# EAGLE design Stick IMUinator v2.1 (EAGLE 6.2)
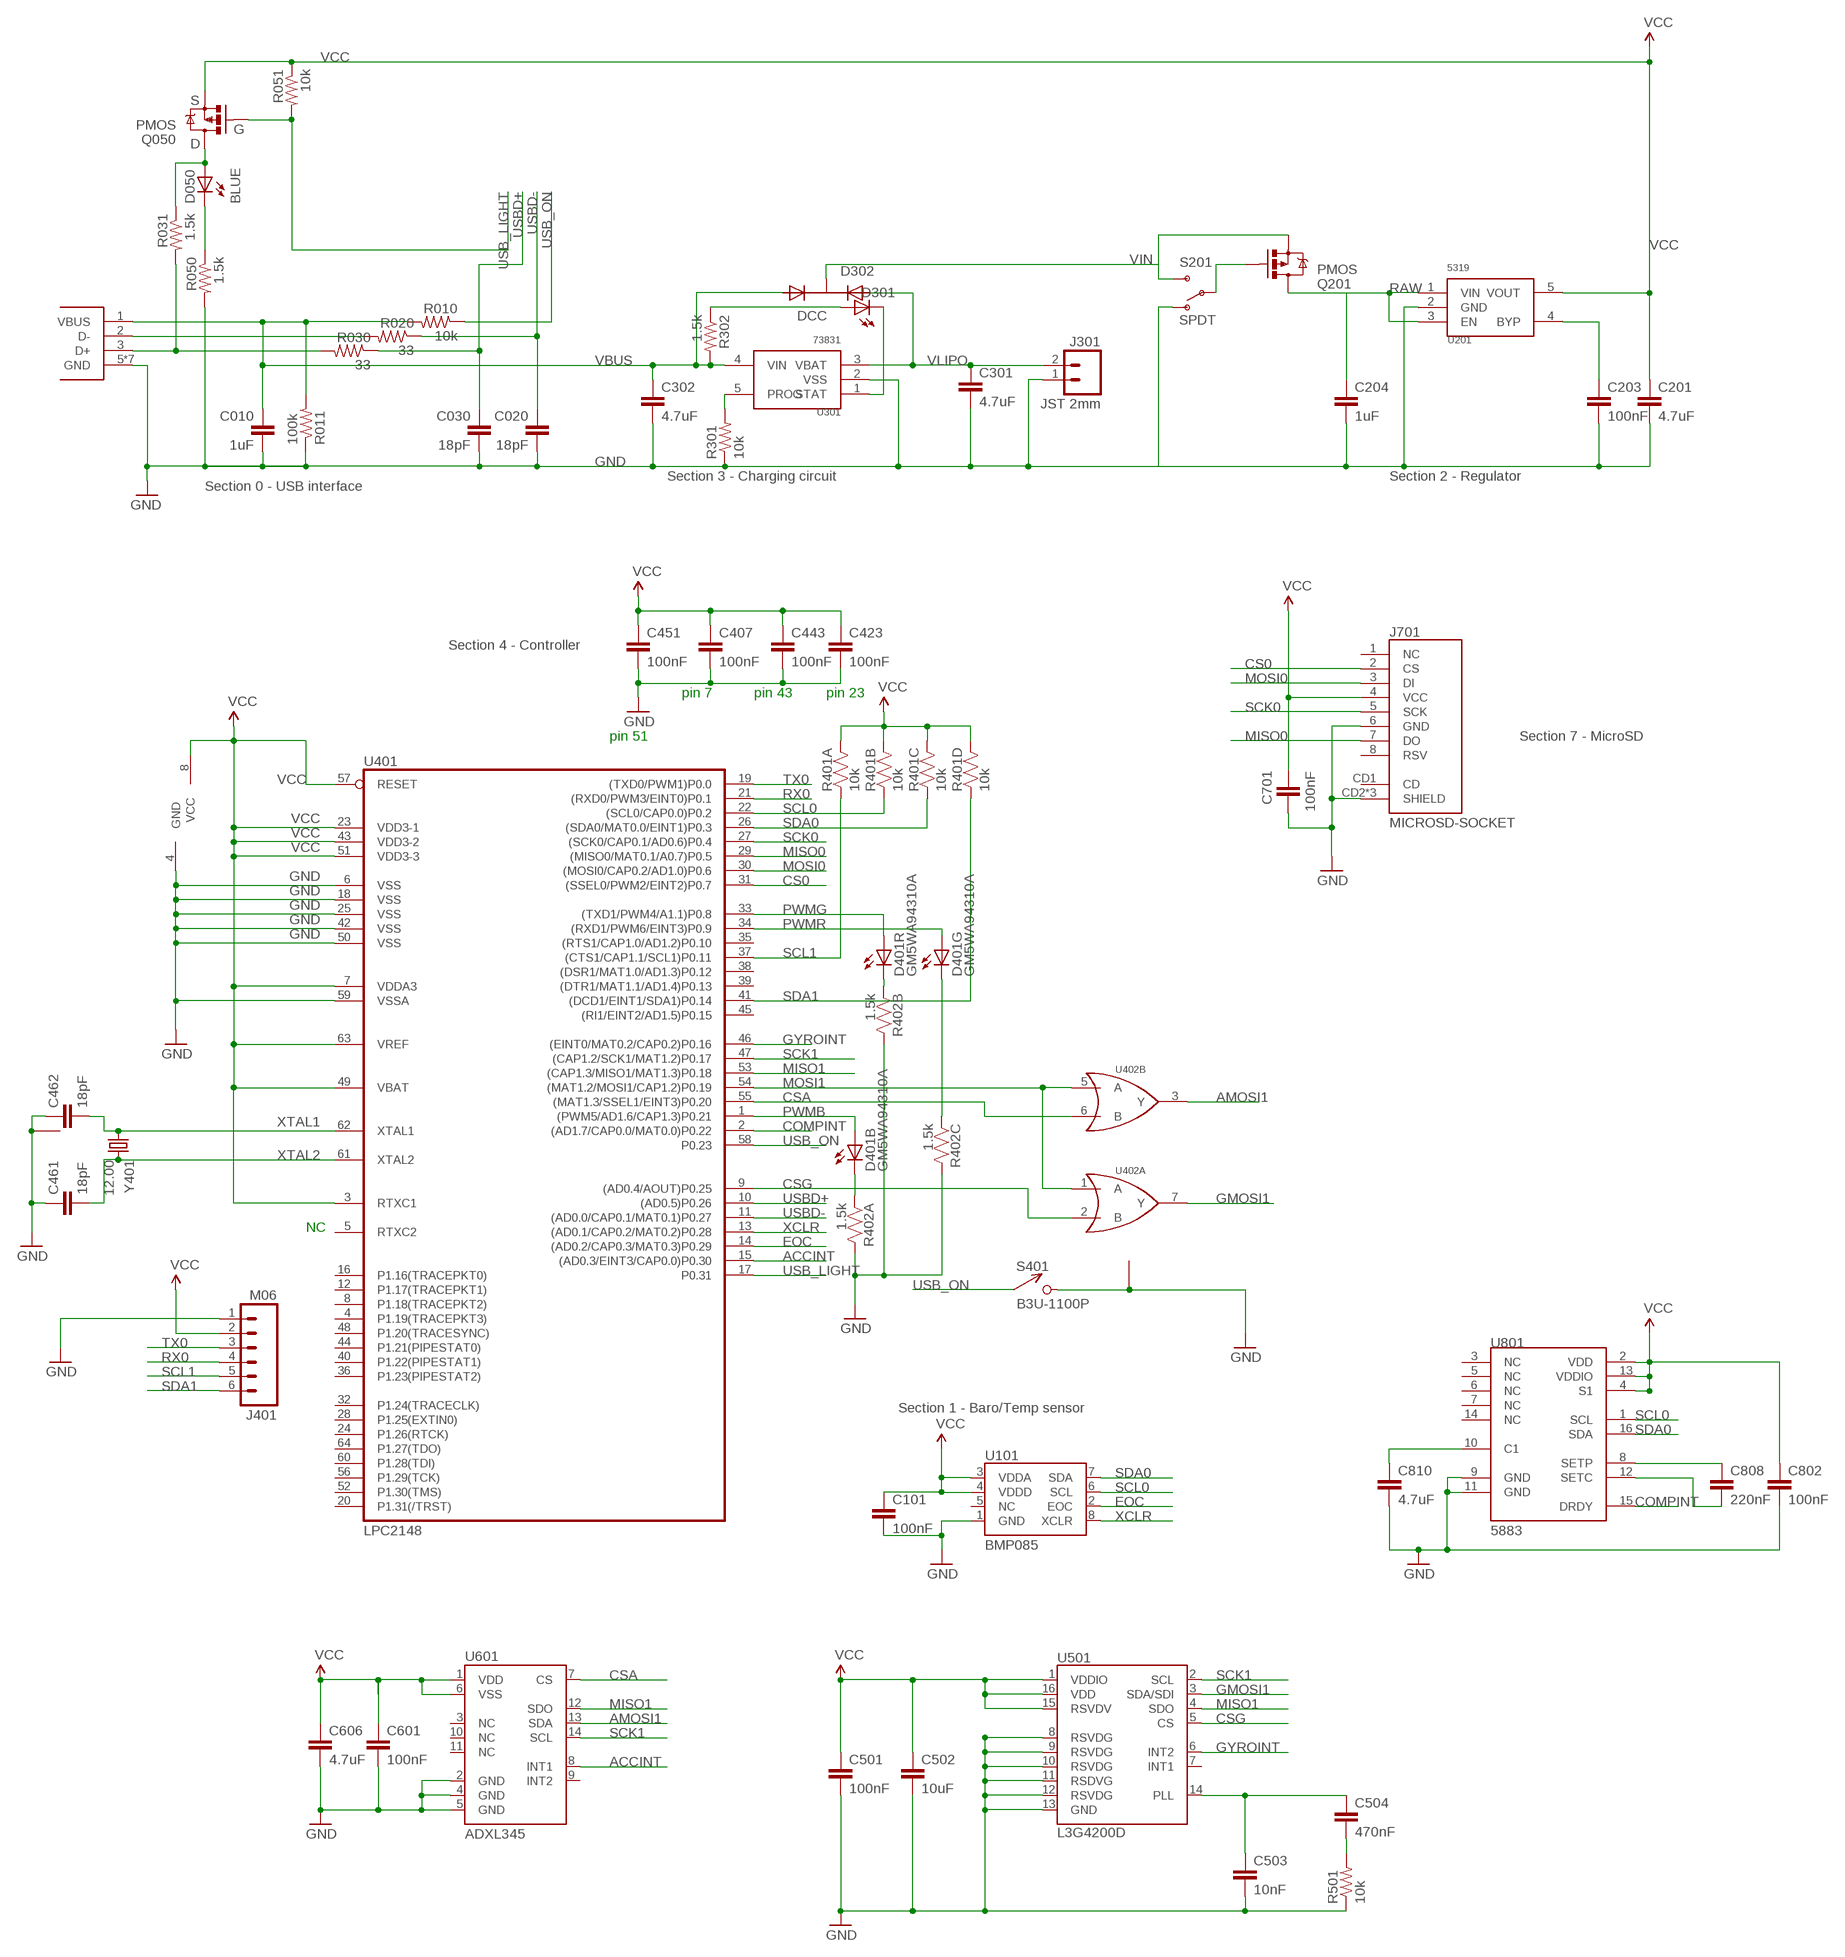
[diagram p0: schematic, sheet 1]

## Parts
C010  1uF  CAP0402-CAP  [0402-CAP]
C020  18pF  CAP0402-CAP  [0402-CAP]
C030  18pF  CAP0402-CAP  [0402-CAP]
C101  100nF  CAP0402-CAP  [0402-CAP]
C201  4.7uF  CAP0402-CAP  [0402-CAP]
C203  100nF  CAP0402-CAP  [0402-CAP]
C204  1uF  CAP0402-CAP  [0402-CAP]
C301  4.7uF  CAP0402-CAP  [0402-CAP]
C302  4.7uF  CAP0402-CAP  [0402-CAP]
C407  100nF  CAP0402-CAP  [0402-CAP]
C423  100nF  CAP0402-CAP  [0402-CAP]
C443  100nF  CAP0402-CAP  [0402-CAP]
C451  100nF  CAP0402-CAP  [0402-CAP]
C461  18pF  CAP0402-CAP  [0402-CAP]
C462  18pF  CAP0402-CAP  [0402-CAP]
C501  100nF  CAP0402-CAP  [0402-CAP]
C502  10uF  CAP0603-CAP  [0603-CAP]
C503  10nF  CAP0402-CAP  [0402-CAP]
C504  470nF  CAP0402-CAP  [0402-CAP]
C601  100nF  CAP0402-CAP  [0402-CAP]
C606  4.7uF  CAP0402-CAP  [0402-CAP]
C701  100nF  CAP0402-CAP  [0402-CAP]
C802  100nF  CAP0402-CAP  [0402-CAP]
C808  220nF  CAP0402-CAP  [0402-CAP]
C810  4.7uF  CAP0402-CAP  [0402-CAP]
D050  BLUE  LED0603  [LED-0603]
D301  YELLOW  LED0603  [LED-0603]
D302  DCC  PMEG2005CT  [SOT-23-3]
D401  GM5WA94310A  [GM5WA94310A]
J001  USB_MICROB_JST  [UB-MC5BR3-SD204-4S]
J301  JST 2mm  M02-JST-2MM-SMT  [JST-2-SMD]
J401  M06  M06LOCK  [1X06_LOCK]
J701  MICROSD-SOCKET  [MICROSD-SOCKET-PP]
Q050  PMOS  MOSFET-PCHANNELSMD  [SOT23-3]
Q201  PMOS  MOSFET-PCHANNELSMD  [SOT23-3]
R010  10k  RESISTOR0402-RES  [0402-RES]
R011  100k  RESISTOR0402-RES  [0402-RES]
R020  33  RESISTOR0402-RES  [0402-RES]
R030  33  RESISTOR0402-RES  [0402-RES]
R031  1.5k  RESISTOR0402-RES  [0402-RES]
R050  1.5k  RESISTOR0402-RES  [0402-RES]
R051  10k  RESISTOR0402-RES  [0402-RES]
R301  10k  RESISTOR0402-RES  [0402-RES]
R302  1.5k  RESISTOR0402-RES  [0402-RES]
R401  10k  RP404  [CRA04]
R402  1.5k  RP404  [CRA04]
R501  10k  RESISTOR0402-RES  [0402-RES]
S201  SPDT  SWITCH-SPSTSMD  [AYZ0202]
S401  B3U-1100P  [B3U-1100P]
U101  BMP085  [BMP085]
U201  5319  MIC5319D5  [SOT-23-5]
U301  73831  MCP73831  [SOT-23-5]
U401  LPC2148  LPC213X  [SQFP-S-10X10-64]
U402  7432  SN74LVC2G32  [DCU_8]
U501  L3G4200D  [LGA16-4X4]
U601  ADXL345  [LGA14]
U801  5883  HMC5883LSMD  [16LPCC]
Y401  12.00  TSX-3225  [CRYSTAL_SMD]

## Nets
ACCINT: U401.15((AD0.3/EINT3/CAP0.0)P0.30) U601.8(INT1)
AMOSI1: U402.3(B:Y) U601.13(SDA)
COMPINT: U401.2((AD1.7/CAP0.0/MAT0.0)P0.22) U801.15(DRDY)
CONN_D+: J001.3(D+) R030.2 R031.2
CONN_D-: J001.2(D-) R020.2
CS0: J701.2(CS) U401.31((SSEL0/PWM2/EINT2)P0.7)
CSA: U401.55((MAT1.3/SSEL1/EINT3)P0.20) U402.6(B:B) U601.7(CS)
CSG: U401.9((AD0.4/AOUT)P0.25) U402.2(A:B) U501.5(CS)
EOC: U101.2(EOC) U401.14((AD0.2/CAP0.3/MAT0.3)P0.29)
GMOSI1: U402.7(A:Y) U501.3(SDA/SDI)
GND [power]: C010.2 C020.2 C030.2 C101.2 C201.2 C203.2 C204.2 C301.2 C302.2 C407.2 C423.2 C443.2 C451.2 C461.1 C462.1 C501.2 C502.2 C503.2 C601.2 C606.2 C701.2 C802.2 C810.2 J001.5(GND) J001.P$6(GND) J001.P$7(GND) J001.P$8(GND) J001.P$9(GND) J001.P$10(GND) J001.P$11(GND) J301.1 J401.1 J701.6(GND) J701.CD2(SHIELD) J701.GND1(SHIELD) J701.GND3(SHIELD) R011.1 R050.2 R301.1 R402.6 R402.7 R402.8 R501.1 S201.1(O) S401.P$2 S401.P$3 U101.1(GND) U201.2(GND) U301.2(VSS) U401.6(VSS) U401.18(VSS) U401.25(VSS) U401.42(VSS) U401.50(VSS) U401.59(VSSA) U402.4(PWR:GND) U501.8(RSVDG) U501.9(RSVDG) U501.10(RSVDG) U501.11(RSDVG) U501.12(RSVDG) U501.13(GND) U601.2(GND) U601.4(GND) U601.5(GND) U801.9(GND) U801.11(GND) Y401.2 Y401.4
GYROINT: U401.46((EINT0/MAT0.2/CAP0.2)P0.16) U501.6(INT2)
MISO0: J701.7(DO) U401.29((MISO0/MAT0.1/A0.7)P0.5)
MISO1: U401.53((CAP1.3/MISO1/MAT1.3)P0.18) U501.4(SDO) U601.12(SDO)
MOSI0: J701.3(DI) U401.30((MOSI0/CAP0.2/AD1.0)P0.6)
MOSI1: U401.54((MAT1.2/MOSI1/CAP1.2)P0.19) U402.1(A:A) U402.5(B:A)
N$1: C504.2 R501.2
N$2: R301.2 U301.5(PROG)
N$3: D401.4(G:C) R402.3
N$4: D301.C U301.1(STAT)
N$5: D301.A R302.1
N$6: D050.A Q050.3(D) R031.1
N$7: D050.C R050.1
N$8: D401.5(R:C) R402.2
N$10: Q201.1(G) S201.2(P)
N$12: D401.6(B:C) R402.1
N$14: C808.1 U801.8(SETP)
N$15: C808.2 U801.12(SETC)
N$16: C810.1 U801.10(C1)
N$17: C203.1 U201.4(BYP)
N$20: C503.1 C504.1 U501.14(PLL)
PWMB: D401.1(B:A) U401.1((PWM5/AD1.6/CAP1.3)P0.21)
PWMG: D401.3(G:A) U401.34((RXD1/PWM6/EINT3)P0.9)
PWMR: D401.2(R:A) U401.33((TXD1/PWM4/A1.1)P0.8)
RAW: C204.1 Q201.3(D) U201.1(VIN) U201.3(EN)
RX0: J401.4 U401.21((RXD0/PWM3/EINT0)P0.1)
SCK0: J701.5(SCK) U401.27((SCK0/CAP0.1/AD0.6)P0.4)
SCK1: U401.47((CAP1.2/SCK1/MAT1.2)P0.17) U501.2(SCL) U601.14(SCL)
SCL0: R401.2 U101.6(SCL) U401.22((SCL0/CAP0.0)P0.2) U801.1(SCL)
SCL1: J401.5 R401.1 U401.37((CTS1/CAP1.1/SCL1)P0.11)
SDA0: R401.3 U101.7(SDA) U401.26((SDA0/MAT0.0/EINT1)P0.3) U801.16(SDA)
SDA1: J401.6 R401.4 U401.41((DCD1/EINT1/SDA1)P0.14)
TX0: J401.3 U401.19((TXD0/PWM1)P0.0)
USB_LIGHT: Q050.1(G) R051.2 U401.17(P0.31)
USB_ON: R010.1 S401.P$1 U401.58(P0.23)
USBD+: C030.1 R030.1 U401.10((AD0.5)P0.26)
USBD-: C020.1 R020.1 U401.11((AD0.0/CAP0.1/MAT0.1)P0.27)
VBUS: C010.1 C302.1 D302.1(A1) J001.1(VBUS) R010.2 R011.2 R302.2 U301.4(VIN)
VCC [power]: C101.1 C201.1 C407.1 C423.1 C443.1 C451.1 C501.1 C502.1 C601.1 C606.1 C701.1 C802.1 J401.2 J701.4(VCC) Q050.2(S) R051.1 R401.5 R401.6 R401.7 R401.8 U101.3(VDDA) U101.4(VDDD) U201.5(VOUT) U401.3(RTXC1) U401.7(VDDA3) U401.23(VDD3-1) U401.43(VDD3-2) U401.49(VBAT) U401.51(VDD3-3) U401.57(RESET) U401.63(VREF) U402.8(PWR:VCC) U501.1(VDDIO) U501.15(RSVDV) U501.16(VDD) U601.1(VDD) U601.6(VSS) U801.2(VDD) U801.4(S1) U801.13(VDDIO)
VIN: D302.3(K) Q201.2(S) S201.3(S)
VLIPO: C301.1 D302.2(A2) J301.2 U301.3(VBAT)
XCLR: U101.8(XCLR) U401.13((AD0.1/CAP0.2/MAT0.2)P0.28)
XTAL1: C462.2 U401.62(XTAL1) Y401.1
XTAL2: C461.2 U401.61(XTAL2) Y401.3
Unconnected: J701.1(NC) J701.8(RSV) J701.CD1(CD) R402.4 R402.5 U101.5(NC) U401.4(P1.19(TRACEPKT3)) U401.5(RTXC2) U401.8(P1.18(TRACEPKT2)) U401.12(P1.17(TRACEPKT1)) U401.16(P1.16(TRACEPKT0)) U401.20(P1.31(/TRST)) U401.24(P1.26(RTCK)) U401.28(P1.25(EXTIN0)) U401.32(P1.24(TRACECLK)) U401.35((RTS1/CAP1.0/AD1.2)P0.10) U401.36(P1.23(PIPESTAT2)) U401.38((DSR1/MAT1.0/AD1.3)P0.12) U401.39((DTR1/MAT1.1/AD1.4)P0.13) U401.40(P1.22(PIPESTAT1)) U401.44(P1.21(PIPESTAT0)) U401.45((RI1/EINT2/AD1.5)P0.15) U401.48(P1.20(TRACESYNC)) U401.52(P1.30(TMS)) U401.56(P1.29(TCK)) U401.60(P1.28(TDI)) U401.64(P1.27(TDO)) U501.7(INT1) U601.3(NC) U601.9(INT2) U601.10(NC) U601.11(NC) U801.3(NC) U801.5(NC) U801.6(NC) U801.7(NC) U801.14(NC)

## Notes on the sheet
- S
- G
- D
- Section 0 - USB interface | Section 3 - Charging circuit | Section 2 - Regulator
- Section 4 - Controller
- pin 7 | pin 43 | pin 23
- pin 51 | Section 7 - MicroSD
- NC
- Section 1 - Baro/Temp sensor

## Library data of the parts
C010 C204 = SparkFun:CAP: Capacitor Standard 0603 ceramic capacitor, and 0.1" leaded capacitor.; DIGIKEY: 445-1415-1-ND
C020 C030 C461 C462 = SparkFun:CAP: Capacitor Standard 0603 ceramic capacitor, and 0.1" leaded capacitor.; DIGIKEY: 445-1238-1-ND
C101 C203 C407 C423 C443 C451 C501 C601 C701 C802 = SparkFun:CAP: Capacitor Standard 0603 ceramic capacitor, and 0.1" leaded capacitor.; DIGIKEY: 445-1268-1-ND
C201 C301 C302 C606 C810 = SparkFun:CAP: Capacitor Standard 0603 ceramic capacitor, and 0.1" leaded capacitor.; DIGIKEY: 445-7395-1-ND
C502 = SparkFun:CAP: Capacitor Standard 0603 ceramic capacitor, and 0.1" leaded capacitor.; DIGIKEY: 445-7486-1-ND
C503 = SparkFun:CAP: Capacitor Standard 0603 ceramic capacitor, and 0.1" leaded capacitor.; DIGIKEY: 445-4943-1-ND
C504 = SparkFun:CAP: Capacitor Standard 0603 ceramic capacitor, and 0.1" leaded capacitor.; DIGIKEY: 445-4976-1-ND
C808 = SparkFun:CAP: Capacitor Standard 0603 ceramic capacitor, and 0.1" leaded capacitor.; DIGIKEY: 445-4972-1-ND
D050 D301 = SparkFun:LED: LEDs Standard schematic elements and footprints for 5mm, 3mm, 1206, and 0603 sized LEDs. 5mm - Spark Fun Electronics SKU : COM-00529 (and others); DIGIKEY: 350-2029-1-ND
D302 = KwanSystems:PMEG2005CT; DIGIKEY: 568-6500-1-ND
D401 = led:GM5WA94310A: Chip LED RGB Source: http://document.sharpsma.com/files/GM5WA94310A_SS.pdf; DIGIKEY: 425-2728-1-ND
J001 = KwanSystems:USB_MICROB_JST; DIGIKEY: 455-2562-1-ND
J301 = SparkFun:M02: Header 2 Standard 2-pin 0.1" header. Use with straight break away headers (SKU : PRT-00116), right angle break away headers (PRT-00553), swiss pins (PRT-00743), machine pins (PRT-00117), and female headers (PRT-00115). Molex polarized connector foot print use with SKU : PRT-08233 with associated crimp pins and housings.; DIGIKEY: 455-1749-1-ND
J401 = SparkFun:M06: Header 6 Standard 6-pin 0.1" header. Use with straight break away headers (SKU : PRT-00116), right angle break away headers (PRT-00553), swiss pins (PRT-00743), machine pins (PRT-00117), and female headers (PRT-00115). Molex polarized connector foot print use with SKU : PRT-08094 with associated crimp pins and housings. NOTES ON THE VARIANTS LOCK and LOCK_LONGPADS... This footprint was designed to help hold the alignment of a through-hole component (i.e. 6-pin header) while soldering it into place. You may notice that each hole has been shifted either up or down by 0.005 of an inch from it's more standard position (which is a perfectly straight line). This slight alteration caused the pins (the squares in the middle) to touch the edges of the holes. Because they are alternating, it causes a "brace" to hold the component in place. 0.005 has proven to be the perfect amount of "off-center" position when using our standard breakaway headers. Although looks a little odd when you look at the bare footprint, once you have a header in there, the alteration is very hard to notice. Also, if you push a header all the way into place, it is covered up entirely on the bottom side. This idea of altering the position of holes to aid alignment will be further integrated into the Sparkfun Library for other footprints. It can help hold any component with 3 or more connection pins.; DIGIKEY: $NOPART
J701 = KwanSystems:MICROSD-SOCKET: microSD Socket Push-push type uSD socket. Digikey 101-00660-68-6-1-ND. tDoc lines correctly indicate media card edge positions when inserting (unlocked, locked, depressed).; DIGIKEY: 101-00581-59-1-ND
Q050 Q201 = SparkFun:MOSFET-PCHANNEL; DIGIKEY: NTR1P02T1GOSCT-ND
R010 R051 R301 R501 = SparkFun:RESISTOR: Resistor Basic schematic elements and footprints for 0603, 1206, and PTH resistors.; DIGIKEY: P10.0KLCT-ND
R011 = SparkFun:RESISTOR: Resistor Basic schematic elements and footprints for 0603, 1206, and PTH resistors.; DIGIKEY: P100KLCT-ND
R020 R030 = SparkFun:RESISTOR: Resistor Basic schematic elements and footprints for 0603, 1206, and PTH resistors.; DIGIKEY: P33.0LCT-ND
R031 R050 R302 = SparkFun:RESISTOR: Resistor Basic schematic elements and footprints for 0603, 1206, and PTH resistors.; DIGIKEY: P1.50KLCT-ND
R401 = KwanSystems:RP4; DIGIKEY: CRA4S810KCT-ND
R402 = KwanSystems:RP4; DIGIKEY: CRA4S81.5KCT-ND
S201 = SparkFun:SWITCH-SPST: SPST Switch Simple slide switch. Spark Fun Electronics SKU : COM-00102; DIGIKEY: 401-2013-1-ND
S401 = KwanSystems:B3U-1100P; DIGIKEY: SW1021CT-ND
U101 = SparkFun:BMP085: BMP085 Pressure Sensor Great little MEMS pressure sensor. SKU: COM-09603; DIGIKEY: 828-1005-1-ND
U201 = KwanSystems:MIC5319; DIGIKEY: 576-1910-1-ND
U301 = KwanSystems:MCP73831; DIGIKEY: MCP73831T-2ACI/OTCT-ND
U401 = SparkFun:LPC213X: LPC213x Schematic element and footprint for NXP LPC213x. Spark Fun Electronics SKU : COM-00520; DIGIKEY: 568-1765-ND
U402 = KwanSystems:SN74LVC2G32; DIGIKEY: 296-13268-1-ND
U501 = SparkFun:L3G4200D: L3G4200D Three-axis, digital output gyroscope The L3G4200D is a low-power three-axis angular rate sensor, has a full scale of ±250/±500/±2000 dps and is capable of measuring rates with a user-selectable bandwidth. It includes a sensing element and an IC interface capable of providing the measured angular rate to the external world through a digital interface (I2C/SPI). Package: 4x4x1.1 LGA-16 (LGA16-4x4.PAC); DIGIKEY: 497-11071-1-ND
U601 = SparkFun:ADXL345; DIGIKEY: ADXL345BCCZ-RL7CT-ND
U801 = SparkFun:HMC5883L: 3 Axis Digital Compass IC; DIGIKEY: 342-1082-1-ND
Y401 = KwanSystems:TSX-3225; DIGIKEY: 887-1316-1-ND

## Net classes
0 default: width 0.152 mm, drill 0.33 mm, clearance 0.152 mm
1 power: width 0.152 mm, drill 0.33 mm, clearance 0.152 mm to class 0, clearance 0.152 mm
2 hv: width 0.152 mm, drill 0.33 mm, clearance 0.152 mm to class 0, clearance 0.152 mm to class 1, clearance 0.152 mm

## Board
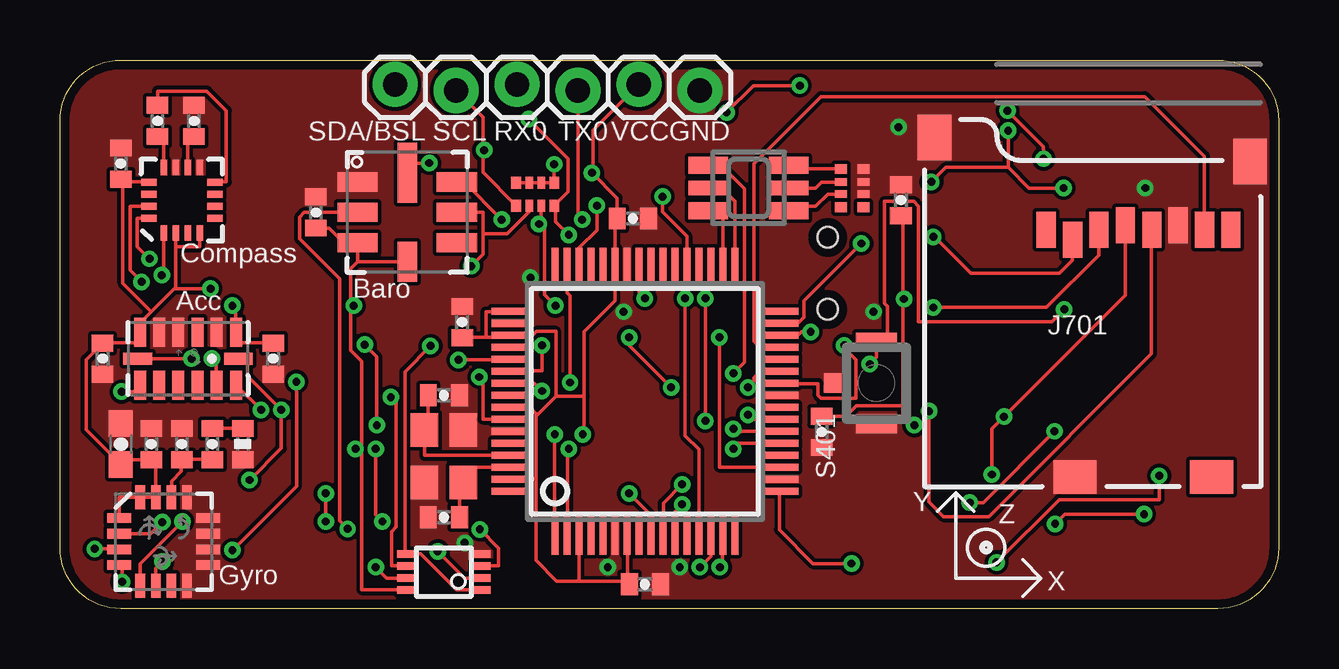
[diagram p1: board, top side]
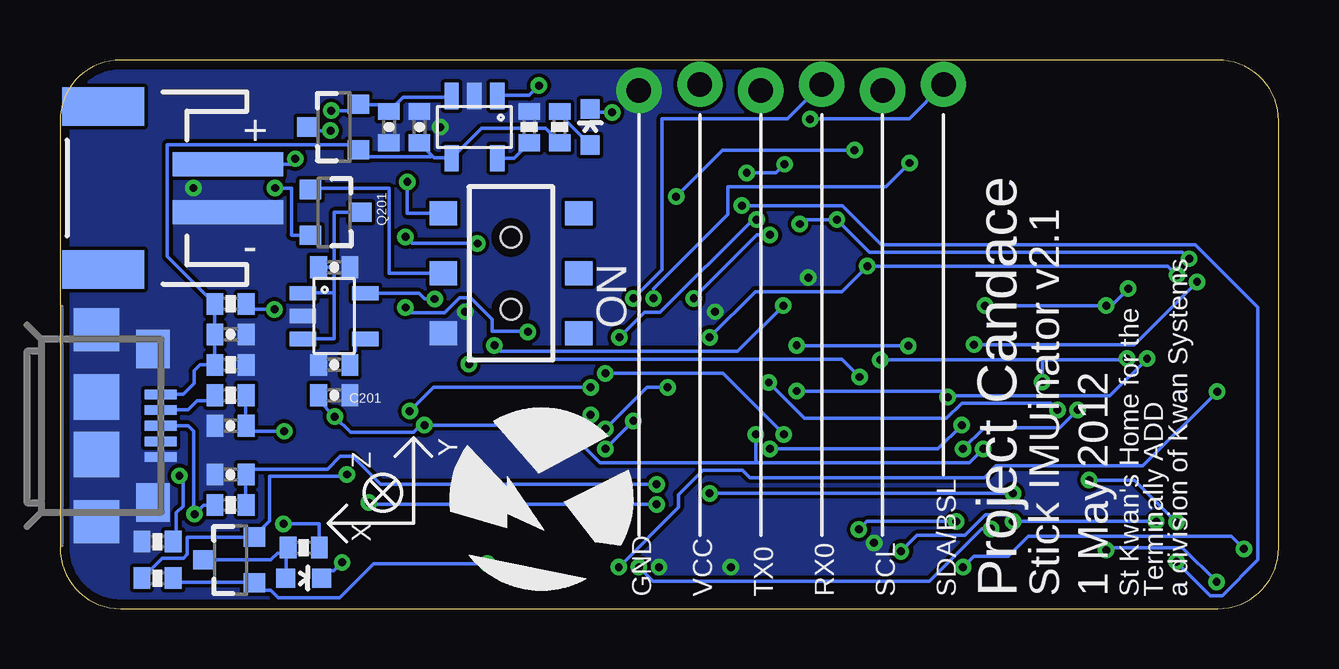
[diagram p2: board, bottom side, seen from below]

Size 50.8 x 22.86 mm. Coordinates in mm from the lower left corner, seen from the top.
Outline: 2.54,22.86 48.26,22.86 arc-90 50.8,20.32 50.8,2.54 arc-90 48.26,0 2.54,0 arc-90 0,2.54 0,20.32 arc-90 2.54,22.86
Copper layers (1*16): Top 0.0356mm / dielectric 1.5011mm / Bottom 0.0356mm
Design rules: minimum track width 6mil, minimum drill 13mil, track to track 6mil, track to pad 6mil, pad to pad 6mil, via to via 6mil, smd to smd 6mil, copper to edge 15mil, drill to drill 6mil, minimum pad ring 7mil, minimum via ring 7mil, stop-mask expansion 4mil, vias tented up to drill 14mil, thermal gap 10mil
tRestrict: area 4.1,16 to 6.1,18; area 6.1,18 to 6.9,18.8; area 6.1,15.2 to 6.9,16; area 3.3,18 to 4.1,18.8; area 3.3,15.2 to 4.1,16
bRestrict: area 3.3,15.2 to 6.9,18.8

### Footprints (pad centres in the part's own frame; a part is rotated, then mirrored left to right if it is on the bottom)
0402-CAP = smd 0.7 x 0.9: 1 -0.65,0; 2 0.65,0
0603-CAP = smd 1.1 x 1: 1 -0.85,0; 2 0.85,0
LED-0603 = smd 0.8 x 0.8: A 0,-0.75; C 0,0.75
SOT-23-3 = smd 0.9 x 0.8: 1 -1,0.95; 2 -1,-0.95; 3 1.1,0
GM5WA94310A = smd 0.7 x 1.65: 1 -0.95,-1.675; 3 0.95,-1.675; 4 0.95,1.675; 6 -0.95,1.675 | smd 0.6 x 1.65: 2 0,-1.675; 5 0,1.675
UB-MC5BR3-SD204-4S = smd 0.4 x 1.35: 1 -1.3,2.675; 2 -0.65,2.675; 3 0,2.675; 4 0.65,2.675; 5 1.3,2.675 | smd 1.8 x 1.9: P$6 4,0; P$7 -4,0 | smd 1.9 x 1.9: P$8 -1.2,0; P$9 1.2,0 | smd 1.6 x 1.4: P$10 -3.2,2.35; P$11 3.2,2.35
JST-2-SMD = smd 1 x 4.6: 1 -1,-3.7; 2 1,-3.7 | smd 1.6 x 3.4: NC1 -3.4,1.5; NC2 3.4,1.5
1X06_LOCK = drill 1.016 pad 1.88: 1 0,0; 2 2.54,-0.254; 3 5.08,0; 4 7.62,-0.254; 5 10.16,0; 6 12.7,-0.254
MICROSD-SOCKET-PP = smd 0.8 x 1.5: 1 -8.94,10.7; 2 -7.84,10.3; 3 -6.74,10.7; 4 -5.64,10.9; 5 -4.54,10.7; 6 -3.44,10.9; 7 -2.34,10.7; 8 -1.24,10.7 | smd 1.8 x 1.4: CD1 -2.05,0.4; CD2 -7.75,0.4 | smd 1.4 x 1.9: GND1 -13.6,14.55; GND3 -0.45,13.55
SOT23-3 = smd 0.8 x 0.9: 1 -0.95,-1; 2 0.95,-1; 3 0,1.1
0402-RES = smd 0.7 x 0.9: 1 -0.65,0; 2 0.65,0
CRA04 = smd 0.4 x 0.5: 1 -0.8,-0.475; 4 0.8,-0.475; 5 0.8,0.475; 8 -0.8,0.475 | smd 0.3 x 0.5: 2 -0.25,-0.475; 3 0.25,-0.475; 6 0.25,0.475; 7 -0.25,0.475
AYZ0202 = smd 1 x 1.15: 1 -2.5,2.825; 2 0,2.825; 3 2.5,2.825; 4 -2.5,-2.825; 5 0,-2.825; 6 2.5,-2.825 | hole 0.85: 1.5,0; -1.5,0
B3U-1100P = smd 0.8 x 1.7: P$1 -1.7,0; P$2 1.7,0 | smd 0.8 x 1.1: P$3 0,-1.65
BMP085 = smd 1.67 x 0.8: 1 -2.065,1.27; 2 -2.065,0; 3 -2.065,-1.27; 5 2.065,-1.27; 6 2.065,0; 7 2.065,1.27 | smd 0.8 x 1.67: 4 0,-2.065 | smd 0.8 x 2.5: 8 0,1.65
SOT-23-5 = smd 0.6 x 1.1: 1 -0.95,-1.3; 2 0,-1.3; 3 0.95,-1.3; 4 0.95,1.3; 5 -0.95,1.3
SQFP-S-10X10-64 = smd 0.3 x 1.6: 1 -3.75,-5.6; 2 -3.25,-5.6; 3 -2.75,-5.6; 4 -2.25,-5.6; 5 -1.75,-5.6; 6 -1.25,-5.6; 7 -0.75,-5.6; 8 -0.25,-5.6; 9 0.25,-5.6; 10 0.75,-5.6; 11 1.25,-5.6; 12 1.75,-5.6; 13 2.25,-5.6; 14 2.75,-5.6; 15 3.25,-5.6; 16 3.75,-5.6; 33 3.75,5.6; 34 3.25,5.6; 35 2.75,5.6; 36 2.25,5.6; 37 1.75,5.6; 38 1.25,5.6; 39 0.75,5.6; 40 0.25,5.6; 41 -0.25,5.6; 42 -0.75,5.6; 43 -1.25,5.6; 44 -1.75,5.6; 45 -2.25,5.6; 46 -2.75,5.6; 47 -3.25,5.6; 48 -3.75,5.6 | smd 1.6 x 0.3: 17 5.6,-3.75; 18 5.6,-3.25; 19 5.6,-2.75; 20 5.6,-2.25; 21 5.6,-1.75; 22 5.6,-1.25; 23 5.6,-0.75; 24 5.6,-0.25; 25 5.6,0.25; 26 5.6,0.75; 27 5.6,1.25; 28 5.6,1.75; 29 5.6,2.25; 30 5.6,2.75; 31 5.6,3.25; 32 5.6,3.75; 49 -5.6,3.75; 50 -5.6,3.25; 51 -5.6,2.75; 52 -5.6,2.25; 53 -5.6,1.75; 54 -5.6,1.25; 55 -5.6,0.75; 56 -5.6,0.25; 57 -5.6,-0.25; 58 -5.6,-0.75; 59 -5.6,-1.25; 60 -5.6,-1.75; 61 -5.6,-2.25; 62 -5.6,-2.75; 63 -5.6,-3.25; 64 -5.6,-3.75
DCU_8 = smd 0.3 x 0.8: 1 -0.75,-1.55; 2 -0.25,-1.55; 3 0.25,-1.55; 4 0.75,-1.55; 5 0.75,1.55; 6 0.25,1.55; 7 -0.25,1.55; 8 -0.75,1.55
LGA16-4X4 = smd 1 x 0.4: 1 -1.85,0.975; 2 -1.85,0.325; 3 -1.85,-0.325; 4 -1.85,-0.975; 9 1.85,-0.975; 10 1.85,-0.325; 11 1.85,0.325; 12 1.85,0.975 | smd 0.4 x 1: 5 -0.975,-1.85; 6 -0.325,-1.85; 7 0.325,-1.85; 8 0.975,-1.85; 13 0.975,1.85; 14 0.325,1.85; 15 -0.325,1.85; 16 -0.975,1.85
LGA14 = smd 0.5 x 1.2: 1 2,1.1; 2 1.2,1.1; 3 0.4,1.1; 4 -0.4,1.1; 5 -1.2,1.1; 6 -2,1.1; 8 -2,-1.1; 9 -1.2,-1.1; 10 -0.4,-1.1; 11 0.4,-1.1; 12 1.2,-1.1; 13 2,-1.1 | smd 1.2 x 0.5: 7 -2.1,0; 14 2.1,0
16LPCC = smd 0.65 x 0.28: 1 -1.37,0.75; 2 -1.37,0.25; 3 -1.37,-0.25; 4 -1.37,-0.75; 9 1.37,-0.75; 10 1.37,-0.25; 11 1.37,0.25; 12 1.37,0.75 | smd 0.28 x 0.65: 5 -0.75,-1.37; 6 -0.25,-1.37; 7 0.25,-1.37; 8 0.75,-1.37; 13 0.75,1.37; 14 0.25,1.37; 15 -0.25,1.37; 16 -0.75,1.37
CRYSTAL_SMD = smd 1.4 x 1.15: 1 -1.092,-0.813; 2 1.092,-0.813; 3 1.092,0.813; 4 -1.092,0.813

### Placement (x,y rotation side)
C010  43.69,11.43 0 bottom
C020  43.69,7.62 180 bottom
C030  43.69,5.59 180 bottom
C101  10.67,16.51 90 top
C201  39.37,8.89 0 bottom
C203  39.37,10.16 180 bottom
C204  39.37,14.22 0 bottom
C301  37.08,20.07 270 bottom
C302  35.81,20.07 90 bottom
C407  24.38,1.02 0 top
C423  31.75,7.37 270 top
C443  23.88,16.26 0 top
C451  16.76,11.94 90 top
C461  16,8.89 180 top
C462  16,3.81 0 top
C501  3.81,6.86 90 top
C502  2.54,6.86 90 top
C503  5.08,6.86 90 top
C504  6.35,6.86 90 top
C601  8.89,10.41 270 top
C606  1.78,10.41 270 top
C701  35.05,17.02 90 top
C802  2.54,18.54 90 top
C808  4.06,20.32 270 top
C810  5.59,20.32 90 top
D050  40.64,1.27 270 bottom
D301  28.7,20.07 0 bottom
D302  39.37,20.07 180 bottom
D401  28.7,17.53 270 top
J001  49.28,7.62 270 bottom
J301  47.5,17.53 90 bottom
J401  26.67,21.59 180 top
J701  50.05,5.08 0 top
Q050  43.69,2.03 90 bottom
Q201  39.37,16.51 270 bottom
R010  43.69,12.7 180 bottom
R011  43.69,10.16 180 bottom
R020  43.69,8.89 180 bottom
R030  43.69,4.32 180 bottom
R031  40.64,2.54 0 bottom
R050  46.74,2.79 180 bottom
R051  46.74,1.27 0 bottom
R301  31.24,20.07 270 bottom
R302  29.97,20.07 270 bottom
R401  19.81,17.27 0 top
R402  33.02,17.53 270 top
R501  7.62,6.86 90 top
S201  32,13.97 90 bottom
S401  34.04,9.4 270 top
U101  14.48,16.51 0 top
U201  39.37,12.19 270 bottom
U301  33.53,20.07 180 bottom
U401  24.38,8.64 0 top
U402  16,1.52 90 top
U501  4.32,2.79 0 top
U601  5.33,10.41 0 top
U801  5.08,17.02 90 top
U$1  [KWAN_CIRCLE]  30.73,4.57 90 bottom
Y401  16,6.35 90 top

### Tracks (layer width: path | path; a pad name or v marks a point on that pad's centre or on a via)
ACCINT  (via drill 0.33)
  Top 0.152: v27.51,1.73 27.61,1.83 27.61,3.02 U401.15 | v2.56,9.04 3.07,9.04 3.33,9.3 U601.8
  Bottom 0.152: v27.51,1.73 25.02,4.22 25.02,4.75 24,5.77 22.35,5.77 22.05,5.46 12.27,5.46 11.79,5.94 5.66,5.94 v2.56,9.04
AMOSI1  (via drill 0.33)
  Top 0.152: v17.5,3.3 18.29,2.52 18.29,1.78 17.65,1.78 U402.3 | v13.44,3.63 13.16,3.91 v13.16,6.66 | 7.29,9.27 7.32,9.3 U601.13 7.39,9.27 v8.38,8.28
  Bottom 0.152: v17.5,3.3 17.17,3.63 v13.44,3.63 | v8.38,8.28 9.12,7.54 12.27,7.54 v13.16,6.66
COMPINT  (via drill 0.33)
  Top 0.152: v3.4,13.61 2.92,14.1 2.92,16.76 U801.15 | v12.7,11 13.21,10.49 v13.21,7.64 | v21.21,6.66 21.16,6.6 21.16,3.05 U401.2
  Bottom 0.152: v3.4,13.61 6.02,11 v12.7,11 | v13.21,7.64 14.2,6.66 v21.21,6.66
CONN_D+  (via drill 0.33)
  Top 0.152: v41.48,3.53 41.88,3.94 v45.19,3.94
  Bottom 0.152: v41.48,3.53 40.01,3.53 40.01,2.54 R031.2 | R030.2 44.81,4.32 v45.19,3.94 45.21,4.01 45.24,4.01 45.24,7.39 45.47,7.62 J001.3 46.58,7.62
CONN_D-
  Bottom 0.152: R020.2 44.58,8.66 45.09,8.66 45.47,8.28 46.58,8.28 J001.2
CS0  (via drill 0.33)
  Top 0.152: v33.4,15.21 31.01,12.83 31.01,12.14 30.76,11.89 30,11.89 U401.31 | v36.4,15.49 36.45,15.49 37.97,13.97 41.66,13.97 42.2,14.51 42.21,14.51 J701.2
  Bottom 0.152: v36.4,15.49 36.12,15.21 v33.4,15.21
CSA  (via drill 0.33)
  Top 0.152: v13.79,8.81 14.02,8.59 14.02,3.4 13.82,3.2 13.82,1.78 14.43,1.78 U402.6 | v20.09,9.07 19.79,9.37 18.8,9.37 U401.55 | U601.7 v5.49,10.41
  Bottom 0.152: v20.09,9.07 14.05,9.07 v13.79,8.81 13.74,8.87 7.04,8.87 v5.49,10.41
CSG  (via drill 0.33)
  Top 0.152: v11.07,3.63 v11.07,4.8 | U501.5 3.35,0.96 3.35,1.88 v5.11,3.63 | U402.2 16.86,1.27 v15.75,2.39 | v23.72,4.8 24.63,3.89 U401.9
  Bottom 0.152: v15.75,2.39 15.09,3.05 13.08,3.05 12.22,3.91 11.35,3.91 v11.07,3.63 v5.11,3.63 | v11.07,4.8 v23.72,4.8
EOC  (via drill 0.33)
  Top 0.152: v11.99,3.33 11.66,3.66 11.66,13.74 9.98,15.42 9.98,16.31 10.19,16.51 U101.2 | U401.14 27.13,2.19 v26.67,1.73
  Bottom 0.152: v26.67,1.73 26.09,1.14 14.55,1.14 12.37,3.33 v11.99,3.33
GMOSI1  (via drill 0.33)
  Top 0.152: v1.45,2.49 2.46,2.49 U501.3 | U402.7 13.61,1.27 v13.16,1.73
  Bottom 0.152: v1.45,2.49 1.98,3.02 10.44,3.02 11.28,2.18 12.7,2.18 v13.16,1.73
GND  (via drill 0.33)
  Top 0.152: C606.2 | C802.2 2.54,19.2 | C601.2 | C461.1 16.66,8.89 | C451.2 16.76,12.57 | C423.2 | S401.P$2 | C462.1 15.37,3.81 | C443.2 24.51,16.26
  Bottom 0.152: R011.1 43.05,10.16 | C010.2 43.1,11.48 | 31.24,20.7 R301.1 31.19,20.75
  other vias: 45.24,17.53 33.91,12.37 16.87,2.74 22.83,1.73 25.83,1.73 34.95,20.07 19.61,13.79 23.5,12.37
  pour Top (no thermals): 2.54,22.86 48.26,22.86 arc-90 50.8,20.32 50.8,2.54 arc-90 48.26,0 2.54,0 arc-90 0,2.54 0,20.32 arc-90
  pour Bottom (no thermals): 2.54,22.86 48.26,22.86 arc-90 50.8,20.32 50.8,2.54 arc-90 48.26,0 2.54,0 arc-90 0,2.54 0,20.32 arc-90
GYROINT  (via drill 0.33)
  Top 0.152: 4.04,1.73 v4.27,1.96 3.99,1.68 U501.6 4.04,0.99 | U401.46 21.63,15.03 22.38,15.77 v22.38,16.79
  Bottom 0.152: v22.38,16.79 18.19,16.79 16.56,15.16 3.48,15.16 0.86,12.55 0.86,2.03 2.36,0.53 2.85,0.53 v4.27,1.96
MISO0
  Top 0.152: U401.29 29.18,10.9 28.93,11.15 28.93,18.54 31.73,21.34 45.21,21.34 47.7,18.85 47.7,15.78 J701.7
MISO1  (via drill 0.33)
  Top 0.152: 6.53,9.3 U601.12 6.5,9.37 6.5,10.24 v6.33,10.41 | v16.61,10.36 18.77,10.36 U401.53 | v2.59,1.12 2.59,1.7 2.49,1.8 U501.4 | v7.19,2.44 9.86,5.11 v9.86,9.45
  Bottom 0.152: 9.86,10.36 6.38,10.36 v6.33,10.41 | 9.86,10.36 v16.61,10.36 | v2.59,1.12 4.01,2.54 7.09,2.54 v7.19,2.44 | v9.86,9.45 9.86,10.36
MOSI0  (via drill 0.33)
  Top 0.152: v31.29,11.53 30.91,11.53 30.79,11.4 30,11.4 U401.30 | v36.4,12.55 41.12,12.55 43.3,14.72 43.3,15.78 J701.3
  Bottom 0.152: v31.29,11.53 31.32,11.56 32.79,11.56 32.79,12.06 33.68,12.95 34.14,12.95 34.77,12.32 36.17,12.32 v36.4,12.55
MOSI1  (via drill 0.33)
  Top 0.152: U402.1 17.63,0.79 16.54,0.79 15.04,2.29 14.44,2.29 | v20.09,10.97 20.09,9.91 18.8,9.91 U401.54 | v15.44,10.95 14.38,9.88 14.38,2.29 14.44,2.29 | U402.5 14.44,2.29
  Bottom 0.152: v20.09,10.97 20.07,10.95 v15.44,10.95
N$1
  Top 0.152: C504.2 R501.2
N$2
  Bottom 0.152: R301.2 31.24,19.41 31.88,18.77 32.56,18.77 U301.5
N$3
  Top 0.152: D401.4 30.57,16.76 31.5,16.76 32.01,17.28 R402.3
N$4  (via drill 0.33)
  Top 0.152: v27.79,20.68 28.91,21.79 v30.84,21.79
  Bottom 0.152: v27.79,20.68 28.57,20.68 28.7,20.8 D301.C | v30.84,21.79 31.24,21.39 32.56,21.39 U301.1
N$5
  Bottom 0.152: D301.A 29.97,20.6 R302.1
N$6
  Bottom 0.152: D050.A 41.38,1.27 41.38,2.54 R031.1 41.43,2.31 41.73,2.31 42.01,2.03 Q050.3
N$7  (via drill 0.33)
  Top 0.152: v39.04,1.93 41.66,4.55 45.82,4.55 v45.82,5.54
  Bottom 0.152: v39.04,1.93 39.4,1.57 39.57,1.57 39.88,1.27 D050.C | v45.82,5.54 45.67,5.38 45.67,4.27 45.95,3.99 45.95,2.79 R050.1
N$8
  Top 0.152: D401.5 31.5,17.53 31.75,17.78 R402.2
N$10
  Bottom 0.152: Q201.1 40.39,17.46 40.39,17.53 37.08,17.53 37.08,13.97 S201.2
N$12
  Top 0.152: R402.1 32.54,18.34 30.38,18.34 30.38,18.47 D401.6
N$14
  Top 0.152: C808.1 4.06,21.57 6.12,21.57 6.93,20.75 6.93,17.78 U801.8
N$15
  Top 0.152: U801.12 4.33,19.67 C808.2
N$16
  Top 0.152: U801.10 5.33,19.67 C810.1
N$17
  Bottom 0.152: C203.1 38.71,10.52 38.48,10.74 38.48,11.23 38.08,11.23 U201.4
N$20
  Top 0.152: C504.1 6.35,6.22 5.08,6.22 C503.1 5.08,6.17 5.05,6.15 5.05,5.71 4.65,5.31 U501.14
PWMB  (via drill 0.33)
  Top 0.152: v20.62,7.26 U401.1 | v28.07,9.8 28.52,10.26 28.52,17.5 27.56,18.47 27.05,18.47 D401.1
  Bottom 0.152: v20.62,7.26 23.16,9.8 v28.07,9.8
PWMG
  Top 0.152: U401.34 27.63,16.58 D401.3
PWMR
  Top 0.152: D401.2 27.58,17.53 28.13,16.98 U401.33
RAW
  Bottom 0.152: U201.1 40.66,13.16 39.37,13.16 | U201.3 40.66,11.25 39.37,11.25 39.37,13.16 | Q201.3 39.37,16.51 39.37,14.22 | 39.37,14.22 C204.1 40.13,14.22 | 39.37,13.16 39.37,14.22
RX0  (via drill 0.33)
  Top 0.152: v28.07,6.66 28.07,6.88 U401.21 | v26.9,7.82 v26.9,12.93
  Bottom 0.152: v28.07,6.66 v26.9,7.82 | v26.9,12.93 25.7,14.12 25.7,20.42 20.47,20.42 J401.4
SCK0  (via drill 0.33)
  Top 0.152: v28.68,9.22 28.93,9.47 28.93,9.63 29.18,9.88 U401.27 | v36.22,8.23 36.22,4.45 36.83,3.83 38.71,3.83 45.5,10.62 45.5,15.78 J701.5
  Bottom 0.152: v36.22,8.23 35.23,9.22 v28.68,9.22
SCK1  (via drill 0.33)
  Top 0.152: v21.26,9.42 21.26,13.03 21.13,13.16 U401.47 | U601.14 7.82,10.41 7.82,9.68 v9.22,8.28 | v7.9,5.36 9.22,6.68 v9.22,8.28 | v9.22,8.28 8.97,8.53 | U501.2 3.78,3.12 v4.27,3.61
  Bottom 0.152: v4.27,3.61 6.02,5.36 v7.9,5.36 | v9.22,8.28 9.5,8.56 13.21,8.56 13.84,7.92 19.76,7.92 v21.26,9.42
SCL0  (via drill 0.33)
  Top 0.152: 17.63,15.62 18.64,15.62 19.56,16.54 R401.2 | v4.24,13.89 4.32,13.97 4.32,15.65 U801.1 | v17.14,14.28 17.63,14.76 17.63,15.62 | v28.07,7.49 28.07,7.39 U401.22 | v25.48,9.22 23.72,10.97 v23.72,11.3 | U101.6 17.63,16.51 17.63,15.62
  Bottom 0.152: v4.24,13.89 4.62,14.28 v17.14,14.28 18.21,13.21 21.82,13.21 v23.72,11.3 | v28.07,7.49 26.34,9.22 v25.48,9.22
SCL1  (via drill 0.33)
  Top 0.152: 17.63,19.1 17.63,20.47 J401.5 | 17.63,19.1 17.63,18.19 19,16.82 R401.1 | 17.63,19.1 v17.68,19.1 | U401.37 26.13,15.52 25.12,16.54 v25.12,17.17
  Bottom 0.152: v25.12,17.17 23.19,19.1 v17.68,19.1
SDA0  (via drill 0.33)
  Top 0.152: v18.41,16.2 16.84,17.78 U101.7 | v3.73,14.58 3.23,15.09 3.23,16.26 3.71,16.26 U801.16 | v32.69,10.97 32.69,10.85 33.17,10.36 33.17,8.76 31.73,8.76 31.6,8.89 31.6,9.37 30,9.37 U401.26 | v20.65,12.62 20.19,13.08 20.19,15.9 20.06,16.03 | 20.06,16.03 R401.3 | v19.96,16.03 20.06,16.03
  Bottom 0.152: v19.96,16.03 19.79,16.2 v18.41,16.2 17.07,14.86 4.01,14.86 v3.73,14.58 | v32.69,10.97 32.44,10.72 22.55,10.72 v20.65,12.62
SDA1  (via drill 0.33)
  Top 0.152: v19.53,20.4 21.18,18.75 21.18,17.37 20.62,16.82 R401.4 20.65,16.74 20.65,16.13 v21.21,15.57 | U401.41 24.13,13.18 v24.38,12.93
  Bottom 0.152: v19.53,20.4 19.51,20.42 15.39,20.42 J401.6 | v24.38,12.93 21.74,15.57 v21.21,15.57
TX0  (via drill 0.33)
  Top 0.152: v27.48,11.3 27.48,5.89 U401.19 | v21.77,16.2 21.59,16.38 J401.3
  Bottom 0.152: v27.48,11.3 26.44,12.34 25.78,12.34 21.92,16.2 v21.77,16.2
USB_LIGHT  (via drill 0.33)
  Top 0.152: U401.17 29.98,3.29 31.39,1.88 v32.99,1.88
  Bottom 0.152: R051.2 46.08,1.27 45.9,1.09 42.7,1.09 Q050.1 42.62,1.04 42.34,0.76 42.01,0.76 41.71,0.46 39.14,0.46 37.72,1.88 v32.99,1.88 33.35,1.88
USB_ON  (via drill 0.33)
  Top 0.152: S401.P$1 | v17.48,9.65 17.63,9.5 17.63,7.9 U401.58 | v33.76,10.19 34.04,10.46 S401.P$1 | S401.P$1 34.49,11.1 34.49,12.6 34.37,12.72 34.37,16.97 35.59,16.97 35.79,16.76 35.79,11.96 41.35,11.96 v41.86,12.47
  Bottom 0.152: 42.98,12.65 43.03,12.7 R010.1 43.04,12.47 v41.86,12.47 | v17.48,9.65 18.21,10.39 33.55,10.39 v33.76,10.19
USBD+  (via drill 0.33)
  Top 0.152: v25.93,5.18 25.15,4.39 25.15,3.05 U401.10
  Bottom 0.152: R030.1 43.05,4.32 43.05,5.59 C030.1 42.98,5.61 42.77,5.82 39.65,5.82 39.12,6.35 38.61,6.35 37.44,5.18 v25.93,5.18
USBD-  (via drill 0.33)
  Top 0.152: v25.93,4.34 25.65,4.06 25.65,3.05 U401.11 | v41.45,7.39 38.48,4.42 v37.92,4.42
  Bottom 0.152: v25.93,4.34 37.85,4.34 v37.92,4.42 | R020.1 43.05,8.89 43.05,7.62 C020.1 42.98,7.59 42.77,7.39 v41.45,7.39
VBUS
  Bottom 0.152: R011.2 C010.1 44.35,11.48 R010.2 44.4,12.75 46.33,14.68 46.33,19.33 38.61,19.33 38.43,19.15 D302.1 38.35,19.1 38.08,18.82 35.33,18.82 35.28,18.87 | R011.2 44.4,10.11 | R302.2 29.97,19.43 30.56,20.02 33.22,20.02 34.47,18.77 U301.4 34.54,18.8 35.2,18.8 35.28,18.87 | 35.28,18.87 35.81,19.41 C302.1 | R011.2 44.96,10.16 45.21,9.91 45.21,9.4 45.67,8.94 46.58,8.94 J001.1
VCC  (via drill 0.33)
  Top 0.152: R401.8 19.02,17.75 R401.7 19.63,17.75 20.04,17.75 R401.6 20.14,17.75 R401.5 20.6,17.83 v20.6,18.52 | C443.1 23.22,16.26 | J401.2 22.23,19.94 22.23,18.21 v22.17,18.16 23.23,17.11 C443.1 | U401.7 23.65,3.02 23.65,1.09 C407.1 23.6,1.14 21.63,1.14 | 17.75,11.3 18.77,11.3 18.77,11.38 U401.51 18.85,11.43 19.74,11.43 19.86,11.56 20.68,11.56 20.68,8.84 | 17.75,11.3 16.76,11.3 C451.1 | U401.49 18.77,12.37 17.75,12.37 17.75,11.3 | 19.84,5.41 18.8,5.41 U401.63 | 19.84,8.05 19.84,8.13 19.58,8.38 18.8,8.38 U401.57 | 19.84,8.05 19.84,5.41 | 20.68,8.84 19.89,8.05 19.84,8.05 | U801.13 2.54,17.78 C802.1 2.62,17.73 2.62,13.56 3.81,12.37 | 3.81,12.37 3.35,11.91 3.35,11.53 U601.6 3.33,11.44 3.33,11.43 | 3.81,12.37 4.83,13.39 4.88,13.34 | 12.57,6.66 12.57,10.31 12.12,10.77 12.12,12.7 | 12.57,6.66 12.57,0.79 14.43,0.79 U402.8 | 12.57,6.66 v12.32,6.66 | C101.1 11.22,15.86 12.12,14.96 12.39,15.24 U101.3 12.41,14.45 | 4.88,13.34 v6.27,13.34 | v7.19,12.62 7.32,12.5 7.32,11.53 U601.1 7.34,11.07 8.89,11.07 C601.1 8.89,11.02 | 35.13,8.46 33.2,8.46 32.77,8.03 C423.1 | 35.13,12.9 35.13,16.28 35.05,16.36 C701.1 | 35.13,8.46 35.13,12.9 | 35.13,12.9 v35.18,12.9 | v28.68,8.08 28.68,7.9 U401.23 | 12.41,14.45 U101.4 | 12.12,12.7 12.12,14.15 12.41,14.45 | C443.1 23.13,16.16 U401.43 23.13,12.82 21.84,11.53 21.84,8.84 | 4.88,13.34 4.83,13.34 U801.2 4.83,15.09 5.82,15.09 5.82,15.65 U801.4 | 3.33,11.43 3.33,11.07 1.78,11.07 C606.1 1.09,10.38 1.09,7.46 C502.1 2.54,6.2 3.81,6.2 C501.1 3.99,6.03 U501.15 U501.16 2.47,4.64 U501.1 | 3.33,11.43 U601.6 | v12.24,12.62 12.17,12.7 12.12,12.7 | 19.84,5.41 19.84,2.01 20.7,1.14 21.63,1.14
  Top 0.152: 21.63,1.14 U401.3 | v21.79,7.26 21.84,7.32 21.84,8.84 | 21.84,8.84 20.68,8.84 | v35.61,7.64 35.13,8.13 35.13,8.46 | v38.84,5.59 38.84,7.49 v39.34,8 44.4,13.05 44.4,15.98 J701.4
  Bottom 0.152: v20.6,18.52 20.95,18.16 v22.17,18.16 | v6.27,13.34 6.99,12.62 v7.19,12.62 v12.24,12.62 | 21.79,6.07 28.3,6.07 29.87,7.64 | 21.79,6.07 12.9,6.07 v12.32,6.66 | 21.79,6.07 v21.79,7.26 | R051.1 47.37,1.27 46.53,2.11 45.64,2.11 45.49,2.26 45.49,2.97 Q050.2 42.67,3.05 42.06,3.66 42.06,5.51 38.91,5.51 v38.84,5.59 | 40.01,8.89 C201.1 40.02,8.68 v39.34,8 38.68,7.34 36.07,7.34 35.76,7.64 v35.61,7.64 29.87,7.64 | v35.18,12.9 35.61,12.9 35.84,13.13 38.05,13.13 U201.5 | 29.87,7.64 29.11,7.64 v28.68,8.08
VIN  (via drill 0.33)
  Top 0.152: 39.52,18.39 v39.52,19.91 | 39.52,18.39 36.93,18.39 v36.32,17.78 | 39.52,18.39 40.39,17.53 v41.83,17.53
  Bottom 0.152: 34.85,16.48 S201.3 36.32,16.47 v36.32,17.78 | v39.52,19.91 40.31,19.91 D302.3 | v41.83,17.53 41.15,17.53 41.15,15.56 Q201.2
VLIPO  (via drill 0.33)
  Top 0.152: v39.5,20.75 41,19.25 v41,18.75
  Bottom 0.152: U301.3 34.49,21.36 34.54,21.31 36.5,21.31 37.03,20.78 C301.1 37.36,21.01 38.35,21.01 D302.2 38.43,20.98 38.66,20.75 v39.5,20.75 | v41,18.75 41.22,18.53 J301.2
XCLR  (via drill 0.33)
  Top 0.152: v26.06,12.93 26.06,7.21 26.63,6.64 U401.13 | v15.39,18.57 14.48,18.57 U101.8
  Bottom 0.152: v26.06,12.93 26.06,13.34 22.96,16.43 22.96,17.58 16.38,17.58 v15.39,18.57
XTAL1
  Top 0.152: U401.62 16.8,5.89 Y401.1 16.76,5.18 16.66,5.08 16.66,3.81 C462.2
XTAL2
  Top 0.152: U401.61 15.2,6.39 Y401.3 15.24,7.52 15.34,7.62 C461.2

### Text on the board
tPlace: SDA/BSL | SCL | RX0 | TX0 | VCC | GND | Compass | Baro | Acc | Y | Z | Gyro | X
bPlace: + | - | ON | Y | Z | X | a division of Kwan Systems | Terminally ADD | St Kwan's Home for the | 1 May 2012 | Stick IMUinator v2.1 | Project Candace | SDA/BSL | SCL | RX0 | TX0 | VCC | GND
bDocu: S | D | G